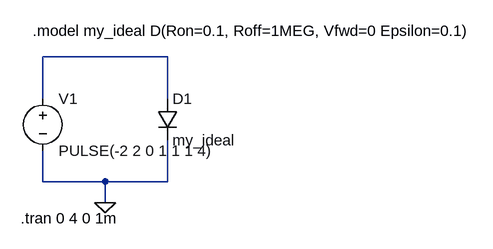
[diagram p0: schematic test-ideal-diode.asc]
test-ideal-diode.asc, the LTspice schematic file:
Version 4
SHEET 1 932 680
WIRE 208 96 16 96
WIRE 16 160 16 96
WIRE 208 160 208 96
WIRE 16 288 16 240
WIRE 112 288 16 288
WIRE 208 288 208 224
WIRE 208 288 112 288
WIRE 112 320 112 288
FLAG 112 320 0
SYMBOL voltage 16 144 R0
WINDOW 123 0 0 Left 0
WINDOW 39 0 0 Left 0
SYMATTR InstName V1
SYMATTR Value PULSE(-2 2 0 1 1 1 4)
SYMBOL diode 192 160 R0
SYMATTR InstName D1
SYMATTR Value my_ideal
TEXT 0 56 Left 2 !.model my_ideal D(Ron=0.1, Roff=1MEG, Vfwd=0 Epsilon=0.1)
TEXT -18 344 Left 2 !.tran 0 4 0 1m

The netlist it stands for:
* test-ideal-diode.asc
V1 N001 0 PULSE(-2 2 0 1 1 1 4)
D1 N001 0 my_ideal
.model D D
.lib standard.dio
.model my_ideal D(Ron=0.1, Roff=1MEG, Vfwd=0 Epsilon=0.1)
.tran 0 4 0 1m
.backanno
.end